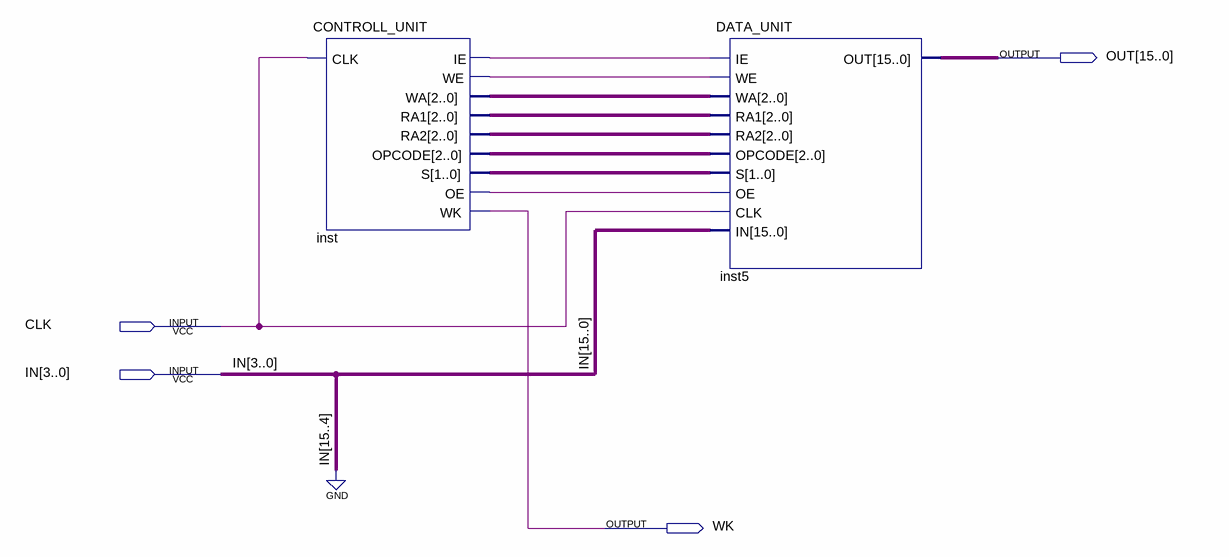
[diagram p0: schematic sheet]
// Quartus schematic LAB03.bdf as structural Verilog: 2 symbols, 4 pins
module LAB03 (
  input  CLK,
  input  [3:0] IN,
  output [15:0] OUT,
  output WK
);

  wire inst_ie, inst_oe, inst_we;
  wire [1:0] inst_s;
  wire [2:0] inst_opcode, inst_ra1, inst_ra2, inst_wa;

  CONTROLL_UNIT inst (
    .CLK(CLK), .IE(inst_ie), .WE(inst_we), .WA(inst_wa), .RA1(inst_ra1), .RA2(inst_ra2),
    .OPCODE(inst_opcode), .S(inst_s), .OE(inst_oe), .WK(WK));
  DATA_UNIT inst5 (
    .IE(inst_ie), .WE(inst_we), .WA(inst_wa), .RA1(inst_ra1), .RA2(inst_ra2), .OPCODE(inst_opcode),
    .S(inst_s), .OE(inst_oe), .CLK(CLK), .IN({{12{1'b0}}, IN}), .OUT(OUT));
endmodule
